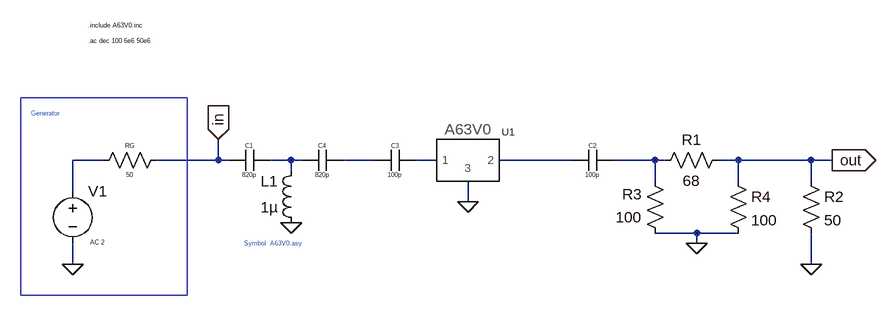
[diagram p0: schematic BGA427_Test_Circuit.asc]
BGA427_Test_Circuit.asc, the LTspice schematic file:
Version 4
SHEET 1 1056 680
WIRE -160 128 -208 128
WIRE 16 128 16 96
WIRE 16 128 -80 128
WIRE 32 128 16 128
WIRE 128 128 96 128
WIRE 144 128 128 128
WIRE 256 128 208 128
WIRE 352 128 320 128
WIRE 560 128 448 128
WIRE 688 128 624 128
WIRE 704 128 688 128
WIRE 816 128 784 128
WIRE 928 128 816 128
WIRE 960 128 928 128
WIRE 128 144 128 128
WIRE 688 160 688 128
WIRE 816 160 816 128
WIRE 928 160 928 128
WIRE -208 176 -208 128
WIRE 400 192 400 160
WIRE 752 240 688 240
WIRE 816 240 752 240
WIRE 752 256 752 240
WIRE -208 288 -208 256
WIRE 928 288 928 240
FLAG 928 288 0
FLAG -208 288 0
FLAG 400 192 0
FLAG 960 128 out
IOPIN 960 128 Out
FLAG 16 96 in
IOPIN 16 96 In
FLAG 128 224 0
FLAG 752 256 0
SYMBOL voltage -208 160 R0
WINDOW 123 27 94 Left 0
WINDOW 39 0 0 Left 0
SYMATTR Value2 AC 2
SYMATTR InstName V1
SYMATTR Value ""
SYMBOL res -176 144 R270
WINDOW 0 32 56 VTop 0
WINDOW 3 0 56 VBottom 0
SYMATTR InstName RG
SYMATTR Value 50
SYMBOL res 912 144 R0
SYMATTR InstName R2
SYMATTR Value 50
SYMBOL cap 560 144 R270
WINDOW 0 32 32 VTop 0
WINDOW 3 0 32 VBottom 0
SYMATTR InstName C2
SYMATTR Value 100p
SYMBOL cap 32 144 R270
WINDOW 0 32 32 VTop 0
WINDOW 3 0 32 VBottom 0
SYMATTR InstName C1
SYMATTR Value 820p
SYMBOL A63V0 400 128 R0
SYMATTR Value A63V0
SYMATTR InstName U1
SYMBOL ind 144 240 R180
WINDOW 0 36 80 Left 2
WINDOW 3 36 40 Left 2
SYMATTR InstName L1
SYMATTR Value 1µ
SYMBOL cap 144 144 R270
WINDOW 0 32 32 VTop 0
WINDOW 3 0 32 VBottom 0
SYMATTR InstName C4
SYMATTR Value 820p
SYMBOL cap 256 144 R270
WINDOW 0 32 32 VTop 0
WINDOW 3 0 32 VBottom 0
SYMATTR InstName C3
SYMATTR Value 100p
SYMBOL res 800 112 R90
WINDOW 0 0 56 VBottom 2
WINDOW 3 32 56 VTop 2
SYMATTR InstName R1
SYMATTR Value 68
SYMBOL res 704 256 R180
WINDOW 0 36 76 Left 2
WINDOW 3 36 40 Left 2
SYMATTR InstName R3
SYMATTR Value 100
SYMBOL res 800 144 R0
SYMATTR InstName R4
SYMATTR Value 100
TEXT -184 -56 Left 0 !.ac dec 100 6e6 50e6
TEXT -272 56 Left 0 ;Generator
TEXT 56 256 Left 0 ;Symbol  A63V0.asy
TEXT -184 -80 Left 0 !.include A63V0.inc
RECTANGLE Normal -32 336 -288 32

The netlist it stands for:
* BGA427_Test_Circuit.asc
V1 N001 0 AC 2
RG N001 in 50
R2 out 0 50
C2 N005 N006 100p
C1 in N002 820p
XU1 N004 N005 0 A63V0 A63V0  ; pins 1 2 3
L1 0 N002 1µ
C4 N002 N003 820p
C3 N003 N004 100p
R1 out N006 68
R3 0 N006 100
R4 out 0 100
.ac dec 100 6e6 50e6
* Generator
* Symbol  A63V0.asy
.include A63V0.inc
.lib A63V0.inc
.backanno
.end

* Results of the author's LTspice run, read from the files saved beside the schematic
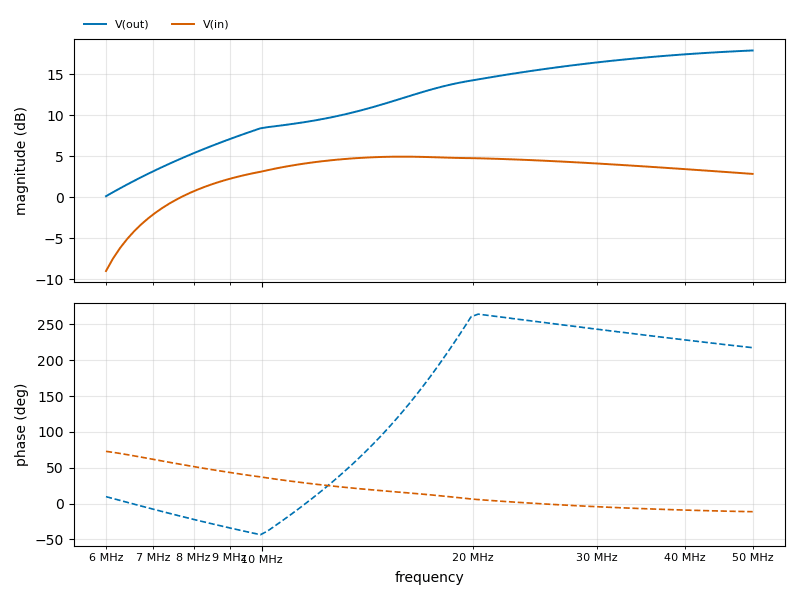
[diagram p1: AC Analysis of BGA427_Test_Circuit.asc, plotted from the saved traces]
* AC Analysis, 1 run:
*   V(out): 0.13 dB at 6 MHz, 17.91 dB at 50 MHz, peak 17.91 dB at 50 MHz, 3 dB below the peak at 22.1 MHz
*   V(in): -9.00 dB at 6 MHz, 2.85 dB at 50 MHz, peak 4.95 dB at 15.78 MHz, 3 dB below the peak at 8.75 MHz